# Altium schematic sheet Stamp_C6LoRa_SMD.SchDoc
size A4; SheetNumber: 1; SheetTotal: 1
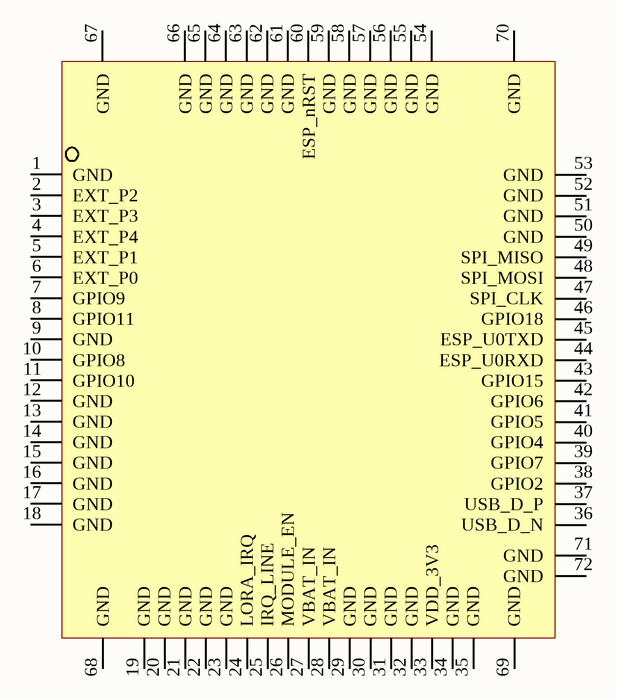
[diagram p0: Stamp_C6LoRa_SMD.SchDoc]

## Parts
M?  S012 Stamp_C6_Lora  [Stamp_C6_Lora_SMD]  (value not drawn)

## Nets

Not connected (* = marked no-connect by the designer): M? 1(GND) 2(EXT_P2) 3(EXT_P3) 4(EXT_P4) 5(EXT_P1) 6(EXT_P0) 7(GPIO9) 8(GPIO11) 9(GND) 10(GPIO8) 11(GPIO10) 12(GND) 13(GND) 14(GND) 15(GND) 16(GND) 17(GND) 18(GND) 19(GND) 20(GND) 21(GND) 22(GND) 23(GND) 24(LORA_IRQ) 25(IRQ_LINE) 26(MODULE_EN) 27(VBAT_IN) 28(VBAT_IN) 29(GND) 30(GND) 31(GND) 32(GND) 33(VDD_3V3) 34(GND) 35(GND) 36(USB_D_N) 37(USB_D_P) 38(GPIO2) 39(GPIO7) 40(GPIO4) 41(GPIO5) 42(GPIO6) 43(GPIO15) 44(ESP_U0RXD) 45(ESP_U0TXD) 46(GPIO18) 47(SPI_CLK) 48(SPI_MOSI) 49(SPI_MISO) 50(GND) 51(GND) 52(GND) 53(GND) 54(GND) 55(GND) 56(GND) 57(GND) 58(GND) 59(GND) 60(ESP_nRST) 61(GND) 62(GND) 63(GND) 64(GND) 65(GND) 66(GND) 67(GND) 68(GND) 69(GND) 70(GND) 71(GND) 72(GND)